# EAGLE design mayfly_peripheral_smd_reva (EAGLE 7.2.0)
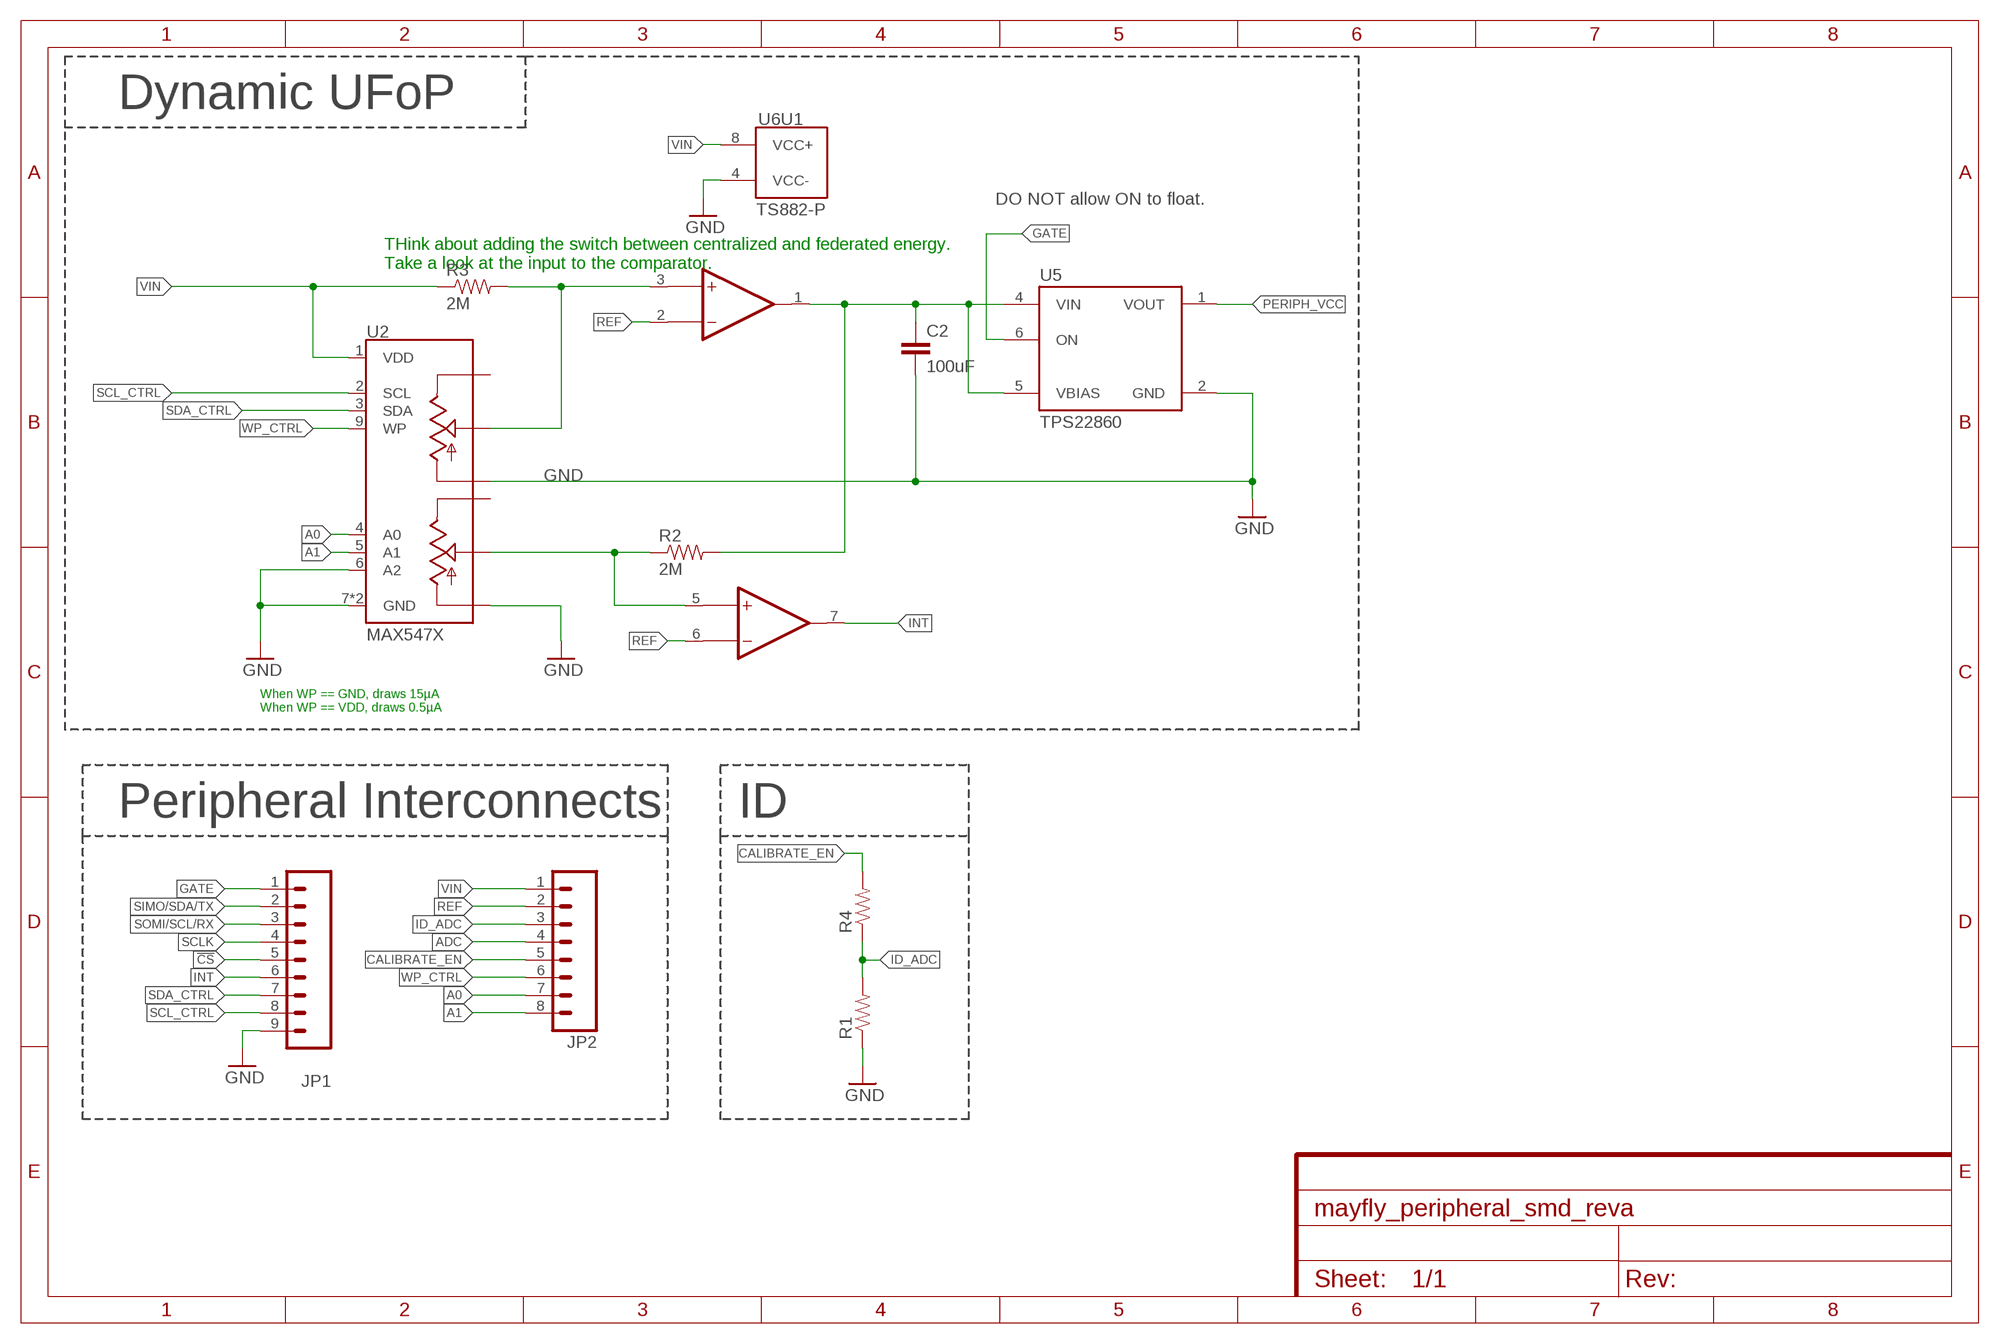
[diagram p0: schematic, sheet 1]
FRAME2 (FRAME-A4L): CNAME: Peripheral Connector Board; CREVISION: A; DESIGNER: Josiah Hester

## Parts
C2  100uF  CAP1210  [1210]
JP1  M091.27MM  [1X09-1.27MM]
JP2  M081X08_1.27MM_SMD  [1X08_1.27MM_SMD]
R1  R-EU0603  [0603]
R2  2M  R-EU0603  [0603]
R3  2M  R-EU0603  [0603]
R4  R-EU0603  [0603]
U2  MAX547X  [QFN16]
U5  TPS22860  [TSOT23-6]
U6  TS882-P  [UDFN8]

## Nets
!CS: JP1.5
A0: JP2.7 U2.4(A0)
A1: JP2.8 U2.5(A1)
ADC: JP2.4
CALIBRATE_EN: JP2.5 R4.2
GATE: JP1.1 U5.6(ON)
GND: C2.2 JP1.9 R1.1 U2.6(A2) U2.7(GND) U2.10(LB) U2.13(LA) U2.TH(GND) U5.2(GND) U6.4(U1:VCC-)
ID_ADC: JP2.3 R1.2 R4.1
INT: JP1.6 U6.7(OP2:OUT1)
N$2: C2.1 R2.2 U5.4(VIN) U5.5(VBIAS) U6.1(OP1:OUT1)
N$4: R3.2 U2.14(WA) U6.3(OP1:IN1+)
N$5: R2.1 U2.11(WB) U6.5(OP2:IN1+)
PERIPH_VCC: U5.1(VOUT)
REF: JP2.2 U6.2(OP1:IN1-) U6.6(OP2:IN1-)
SCL_CTRL: JP1.8 U2.2(SCL)
SCLK: JP1.4
SDA_CTRL: JP1.7 U2.3(SDA)
SIMO/SDA/TX: JP1.2
SOMI/SCL/RX: JP1.3
VIN: JP2.1 R3.1 U2.1(VDD) U6.8(U1:VCC+)
WP_CTRL: JP2.6 U2.9(WP)
Unconnected: U2.12(HB) U2.15(HA)

## Notes on the sheet
- Dynamic UFoP
- DO NOT allow ON to float.
- THink about adding the switch between centralized and federated energy.
  Take a look at the input to the comparator.
- When WP == GND, draws 15µA
  When WP == VDD, draws 0.5µA
- Peripheral Interconnects | ID

## Library data of the parts
C2 = SparkFun-Capacitors:CAP: Capacitor Standard 0603 ceramic capacitor, and 0.1" leaded capacitor.; DIGIKEY: 490-9969-1-ND
JP1 = SparkFun-Connectors:M09: Header 9 Standard 9-pin 0.1" header. Use with straight break away headers (SKU : PRT-00116), right angle break away headers (PRT-00553), swiss pins (PRT-00743), machine pins (PRT-00117), and female headers (PRT-00115).
JP2 = SparkFun-Connectors:M08: Header 8 Standard 8-pin 0.1" header. Use with straight break away headers (SKU : PRT-00116), right angle break away headers (PRT-00553), swiss pins (PRT-00743), machine pins (PRT-00117), and female headers (PRT-00115).; DIGIKEY: 1212-1353-1-ND
R1 R3 R4 = tiny_passives:R-EU
R2 = tiny_passives:R-EU; DIGIKEY: 311-2.00MHRCT-ND
U2 = max547x:MAX547X: MAXIM MAX547X: Dual, 256-Tap, Nonvolatile, I2C-Interface, Digital Potentiometers, 400nA Iq, 250µA 12ms write The MAX5477/MAX5478/MAX5479 nonvolatile, dual, linear-taper, digital potentiometers perform the function of a mechanical potentiometer, but replace the mechanics with a simple 2-wire digital interface. Each device performs the same function as a discrete potentiometer or variable resistor and has 256 tap points. The devices feature an internal, nonvolatile EEPROM used to store the wiper position for initialization during power-up. A write-protect feature prevents accidental overwrites of the EEPROM. The fast-mode I2C-compatible serial interface allows communication at data rates up to 400kbps, minimizing board space and reducing interconnection complexity in many applications. Three address inputs allow a total of eight unique address combinations.; DIGIKEY: MAX5479ETE+-ND
U5 = tps22860:TPS22860: TI: TPS22860 Ultra-Low Leakage Load Switch The TPS22860 is a small, ultra-low leakage current, single channel load switch. The device requires a VBIAS voltage and can operate over an input voltage range of 0 V to VBIAS. It can support a maximum continuous current of 200 mA. The switch is controlled by an on/off input (ON), which is capable of interfacing directly with low-voltage control signals. The TPS22860 is available in two small, space-saving 6-pin SOT-23 and SC70 packages. The device is characterized for operation over the free-air temperature range of –40°C to 85°C.; DIGIKEY: 296-43982-1-ND
U6 = ts882:TS882-P; DIGIKEY: 497-14073-1-ND

## Board
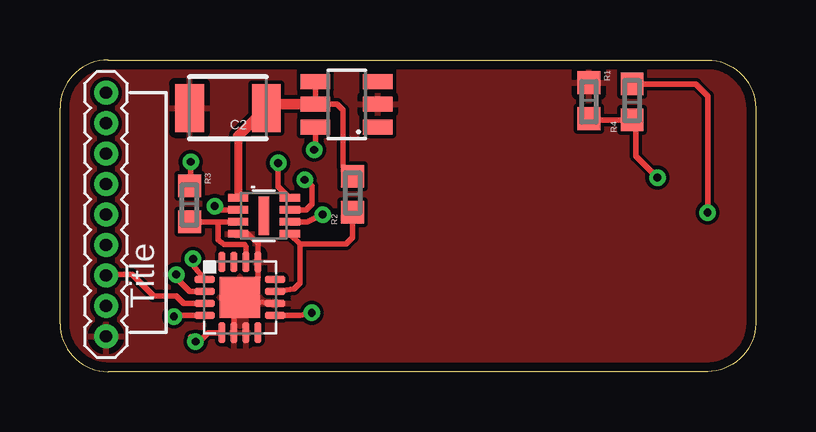
[diagram p1: board, top side]
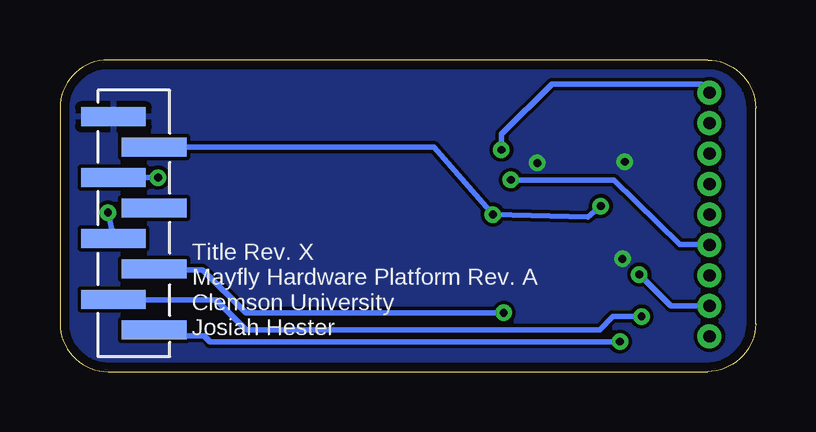
[diagram p2: board, bottom side, seen from below]

Size 29 x 13 mm. Coordinates in mm from the lower left corner, seen from the top.
Outline: 2,13 27,13 arc-90 29,11 29,2 arc-90 27,0 2,0 arc-90 0,2 0,11 arc-90 2,13
Copper layers (1*16): Top 0.0356mm / dielectric 1.5011mm / Bottom 0.0356mm
Design rules "LaenPCBOrder": minimum track width 6mil, minimum drill 13mil, track to track 6mil, track to pad 6mil, pad to pad 6mil, via to via 6mil, smd to smd 6mil, copper to edge 15mil, drill to drill 6mil, minimum pad ring 7mil, minimum via ring 7mil, stop-mask expansion 3mil, vias tented up to drill 0mil, thermal gap 10mil

### Footprints (pad centres in the part's own frame; a part is rotated, then mirrored left to right if it is on the bottom)
1210 = smd 1.2 x 2: 1 -1.6,0; 2 1.6,0
1X09-1.27MM = drill 0.508 pad 1: 1 0,0; 2 1.27,0; 3 2.54,0; 4 3.81,0; 5 5.08,0; 6 6.35,0; 7 7.62,0; 8 8.89,0; 9 10.16,0
1X08_1.27MM_SMD = smd 0.8 x 2.7: 1 0,-0.85; 2 1.27,0.85; 3 2.54,-0.85; 4 3.81,0.85; 5 5.08,-0.85; 6 6.35,0.85; 7 7.62,-0.85; 8 8.89,0.85
0603 = smd 0.95 x 0.95: 1 -0.75,0; 2 0.75,0
QFN16 = smd 0.85 x 0.3: 1 -1.475,0.75; 2 -1.475,0.25; 3 -1.475,-0.25; 4 -1.475,-0.75; 9 1.475,-0.75; 10 1.475,-0.25; 11 1.475,0.25; 12 1.475,0.75 | smd 0.3 x 0.85: 5 -0.75,-1.475; 6 -0.25,-1.475; 7 0.25,-1.475; 8 0.75,-1.475; 13 0.75,1.475; 14 0.25,1.475; 15 -0.25,1.475; 16 -0.75,1.475 | smd 1.7 x 1.7: TH 0,0
TSOT23-6 = smd 0.62 x 1.22: 1 -0.95,-1.3; 2 0,-1.3; 3 0.95,-1.3; 4 0.95,1.3; 5 0,1.3; 6 -0.95,1.3
UDFN8 = smd 0.3 x 0.85: 1 -0.75,-1.075; 2 -0.25,-1.075; 3 0.25,-1.075; 4 0.75,-1.075; 5 0.75,1.075; 6 0.25,1.075; 7 -0.25,1.075; 8 -0.75,1.075 | smd 1.6 x 0.45: TH 0,0

### Placement (x,y rotation side)
C2  7,11 180 top
JP1  1.92,11.63 270 top
JP2  25.92,10.63 270 bottom
R1  22.05,11.3 270 top
R2  12.2,7.4 90 top
R3  5.4,7 270 top
R4  23.85,11.25 90 top
U2  7.5,3.1 0 top
U5  11.95,11.15 90 top
U6  8.5,6.5 270 top

### Tracks (layer width: path | path; a pad name or v marks a point on that pad's centre or on a via)
A0  (via drill 0.33)
  Top 0.222: v4.75,2.3 4.8,2.35 U2.4
  Bottom 0.222: v4.75,2.3 5.95,2.3 6.5,1.75 21.25,1.75 22.5,3 JP2.7
A1  (via drill 0.33)
  Top 0.222: v5.65,1.25 5.45,1.45 5.8,1.25 6.17,1.62 U2.5
  Bottom 0.222: v5.65,1.25 22.75,1.25 23,1.5 24.83,1.5 JP2.8
CALIBRATE_EN  (via drill 0.33)
  Top 0.222: v27,6.63 27,11.5 26.5,12 R4.2
  Bottom 0.222: JP2.5 v27,6.63
GATE  (via drill 0.33)
  Top 0.222: U5.6 10.65,9.65 v10.6,9.25
  Bottom 0.222: JP1.1 2.29,12 8.5,12 10.6,9.9 v10.6,9.25
GND
  Top 0.222: U2.10 7.75,2.95 U2.TH | U2.TH 8.25,3.95 U2.13 8.25,5.35 7.85,5.75 U6.4 | U2.6 7.25,2.95 U2.TH
  pour Top: -0.5,0 28.5,0 28.5,13.5 -0.5,13.5
ID_ADC  (via drill 0.33)
  Top 0.222: v24.91,8.09 24,9 24,10.35 R4.1 22.1,10.5 R1.2
  Bottom 0.222: JP2.3 v24.91,8.09
INT  (via drill 0.33)
  Top 0.222: U6.7 10.25,6.75 10.5,7 10.5,7.75 v10.2,8
  Bottom 0.222: v10.2,8 5.9,8 3.15,5.3 1.94,5.3 JP1.6
N$2
  Top 0.222: U5.4 U5.5 11.55,11.15 11.8,10.9 11.8,8.55 R2.2
  Top 0.333: 7.42,9.82 U6.1
  Top 0.44: U5.5 8.75,11.15 C2.1 7.42,9.82
N$4
  Top 0.222: U6.3 6.6,6.25 | 6.6,6.25 R3.2 | U2.14 7.75,5.2 7.7,5.3 6.85,5.3 6.6,5.5 6.6,6.25
N$5
  Top 0.222: U2.11 9.75,3.45 10,3.7 10,5.33 | 10,5.33 U6.5 | 10,5.33 11.93,5.33 12.2,5.6 R2.1
REF  (via drill 0.33)
  Top 0.222: v10.95,6.55 10.3,6.25 U6.6 | U6.2 6.6,6.75 v6.45,6.9
  Bottom 0.222: JP2.2 13.41,9.36 v10.95,6.55 7,6.45 v6.45,6.9
SCL_CTRL  (via drill 0.33)
  Top 0.222: v4.85,4.05 4.7,4.05 5.4,3.35 U2.2
  Bottom 0.222: JP1.8 3.54,2.74 v4.85,4.05
SDA_CTRL
  Top 0.222: U2.3 5.15,2.85 4.85,3.15 3.9,3.15 3,4.05 1.96,4.05 JP1.7
VIN  (via drill 0.33)
  Top 0.222: v5.55,4.7 5.55,4.42 U2.1 | U6.8 9.1,7.72 v9.1,8.7 | R3.1 5.45,7.95 v5.45,8.75
  pour Bottom: 0,0 28.5,0 28.5,13.5 0,13.5
WP_CTRL  (via drill 0.33)
  Top 0.222: U2.9 10,2.35 v10.5,2.45
  Bottom 0.222: v10.5,2.45 21.25,2.45 23.05,4.25 25.04,4.25 JP2.6

### Text on the board
tPlace: Title
bPlace: Title Rev. X / Mayfly Hardware Platform Rev. A / Clemson University / Josiah Hester